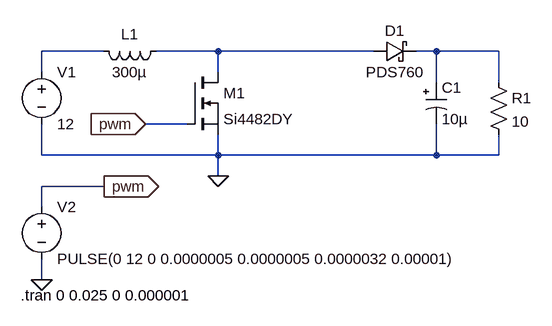
[diagram p0: schematic main.asc]
main.asc, the LTspice schematic file:
Version 4
SHEET 1 880 680
WIRE 128 64 32 64
WIRE 304 64 208 64
WIRE 544 64 304 64
WIRE 640 64 608 64
WIRE 736 64 640 64
WIRE 32 96 32 64
WIRE 304 96 304 64
WIRE 640 112 640 64
WIRE 736 112 736 64
WIRE 256 176 192 176
WIRE 32 224 32 176
WIRE 304 224 304 192
WIRE 304 224 32 224
WIRE 640 224 640 176
WIRE 640 224 304 224
WIRE 736 224 736 192
WIRE 736 224 640 224
WIRE 304 256 304 224
WIRE 128 272 32 272
WIRE 32 304 32 272
WIRE 32 416 32 384
FLAG 304 256 0
FLAG 192 176 pwm
IOPIN 192 176 In
FLAG 32 416 0
FLAG 128 272 pwm
IOPIN 128 272 Out
SYMBOL voltage 32 80 R0
WINDOW 123 0 0 Left 2
WINDOW 39 0 0 Left 2
SYMATTR InstName V1
SYMATTR Value 12
SYMBOL nmos 256 96 R0
SYMATTR InstName M1
SYMATTR Value Si4482DY
SYMBOL schottky 544 80 R270
WINDOW 0 32 32 VTop 2
WINDOW 3 0 32 VBottom 2
SYMATTR InstName D1
SYMATTR Value PDS760
SYMATTR Description Diode
SYMATTR Type diode
SYMBOL polcap 624 112 R0
WINDOW 3 24 56 Left 2
SYMATTR Value 10µ
SYMATTR InstName C1
SYMATTR Description Capacitor
SYMATTR Type cap
SYMATTR SpiceLine V=63 Irms=600m Rser=0.13 Lser=0
SYMBOL res 720 96 R0
SYMATTR InstName R1
SYMATTR Value 10
SYMBOL ind 224 48 R90
WINDOW 0 5 56 VBottom 2
WINDOW 3 32 56 VTop 2
SYMATTR InstName L1
SYMATTR Value 300µ
SYMATTR SpiceLine Ipk=3 Rser=0.168 Rpar=74490 Cpar=6.93p
SYMBOL voltage 32 288 R0
WINDOW 123 0 0 Left 2
WINDOW 39 0 0 Left 2
SYMATTR InstName V2
SYMATTR Value PULSE(0 12 0 0.0000005 0.0000005 0.0000032 0.00001)
TEXT 0 440 Left 2 !.tran 0 0.025 0 0.000001

The netlist it stands for:
* main.asc
V1 N001 0 12
M1 N002 pwm 0 0 Si4482DY
D1 N002 N003 PDS760
C1 N003 0 10µ V=63 Irms=600m Rser=0.13 Lser=0
R1 N003 0 10
L1 N002 N001 300µ Ipk=3 Rser=0.168 Rpar=74490 Cpar=6.93p
V2 pwm 0 PULSE(0 12 0 0.0000005 0.0000005 0.0000032 0.00001)
.model D D
.lib standard.dio
.model NMOS NMOS
.model PMOS PMOS
.lib standard.mos
.tran 0 0.025 0 0.000001
.backanno
.end